# EAGLE design A328 (EAGLE 7.7.0)
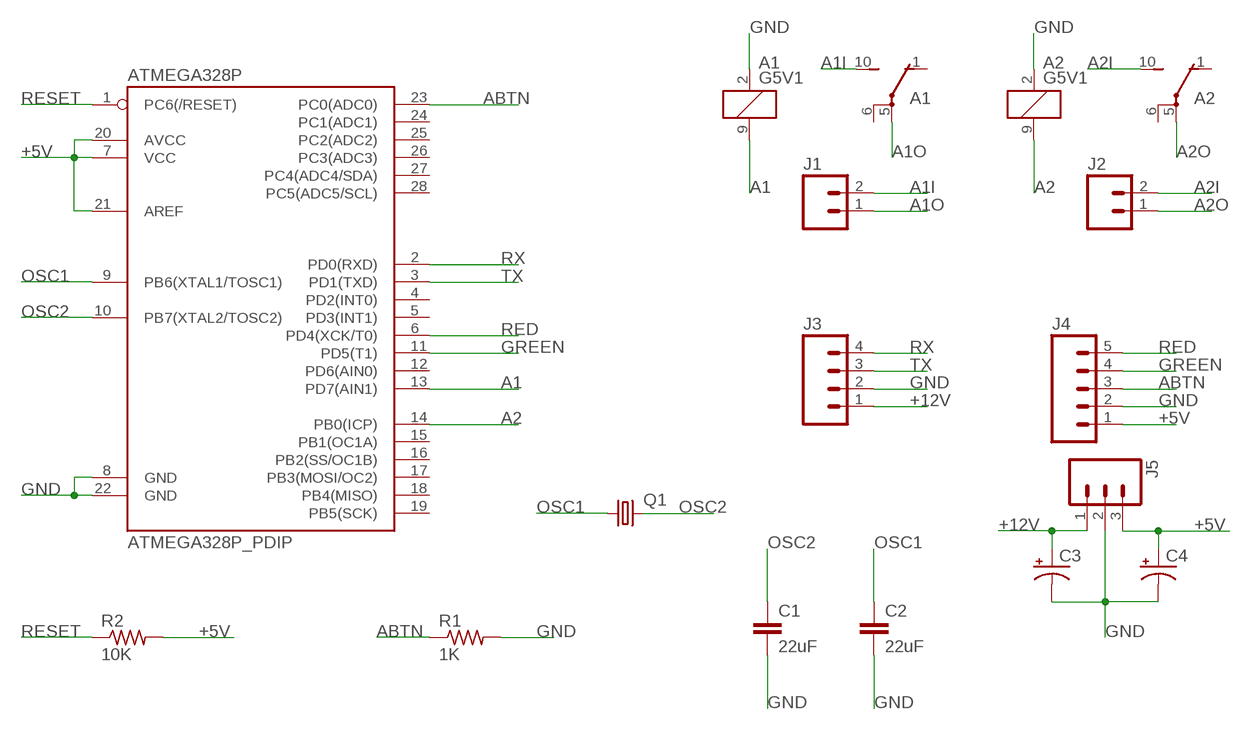
[diagram p0: schematic, sheet 1]

## Parts
A1  G5V1  [G5V1]
A2  G5V1  [G5V1]
ATMEGA328P  ATMEGA328P_PDIP  [DIL28-3]
C1  22uF  CAPKIT  [CAP-PTH-SMALL-KIT]
C2  22uF  CAPKIT  [CAP-PTH-SMALL-KIT]
C3  10UF-25V-20%(PTH)  [CPOL-RADIAL-10UF-25V]
C4  10UF-25V-20%(PTH)  [CPOL-RADIAL-10UF-25V]
J1  M02PTH3  [1X02_LONGPADS]
J2  M02PTH3  [1X02_LONGPADS]
J3  M04NO_SILK_ALL_ROUND  [1X04_NO_SILK_ALL_ROUND]
J4  M05NO_SILK  [1X05_NO_SILK]
J5  M03LONGPADS  [1X03_LONGPADS]
Q1  CRYSTALHC49S  [HC49/S]
R1  1K  R-US_0204/7  [0204/7]
R2  10K  R-US_0204/7  [0204/7]

## Nets
+5V: ATMEGA328P.7(VCC) ATMEGA328P.20(AVCC) ATMEGA328P.21(AREF) C4.1(+) J4.1 J5.3 R2.2
+12V: C3.1(+) J3.1 J5.1
A1: A1.9 ATMEGA328P.13(PD7(AIN1))
A1I: A1.10(2:S) J1.2
A1O: A1.5(2:P) J1.1
A2: A2.9 ATMEGA328P.14(PB0(ICP))
A2I: A2.10(2:S) J2.2
A2O: A2.5(2:P) J2.1
ABTN: ATMEGA328P.23(PC0(ADC0)) J4.3 R1.1
GND: A1.2 A2.2 ATMEGA328P.8(GND) ATMEGA328P.22(GND) C1.2 C2.2 C3.2(-) C4.2(-) J3.2 J4.2 J5.2 R1.2
GREEN: ATMEGA328P.11(PD5(T1)) J4.4
OSC1: ATMEGA328P.9(PB6(XTAL1/TOSC1)) C2.1 Q1.1
OSC2: ATMEGA328P.10(PB7(XTAL2/TOSC2)) C1.1 Q1.2
RED: ATMEGA328P.6(PD4(XCK/T0)) J4.5
RESET: ATMEGA328P.1(PC6(/RESET)) R2.1
RX: ATMEGA328P.2(PD0(RXD)) J3.4
TX: ATMEGA328P.3(PD1(TXD)) J3.3
Unconnected: A1.1(2:O) A1.6(2:P) A2.1(2:O) A2.6(2:P) ATMEGA328P.4(PD2(INT0)) ATMEGA328P.5(PD3(INT1)) ATMEGA328P.12(PD6(AIN0)) ATMEGA328P.15(PB1(OC1A)) ATMEGA328P.16(PB2(SS/OC1B)) ATMEGA328P.17(PB3(MOSI/OC2)) ATMEGA328P.18(PB4(MISO)) ATMEGA328P.19(PB5(SCK)) ATMEGA328P.24(PC1(ADC1)) ATMEGA328P.25(PC2(ADC2)) ATMEGA328P.26(PC3(ADC3)) ATMEGA328P.27(PC4(ADC4/SDA)) ATMEGA328P.28(PC5(ADC5/SCL))

## Library data of the parts
A1 A2 = relay:G5V1: RELAY 1 x switch, 0.5 A/125 V AC, 1 A/24 V DC , Omron; MPN: G5V-1-DC24; OC_FARNELL: 9949593; OC_NEWARK: 36M6377
ATMEGA328P = SparkFun-DigitalIC:ATMEGA328P_PDIP: uC used in the Arduino 32kb flash, 1k EEPROM, 2k SRAM This is the through-hole version of this chip.
C1 C2 = SparkFun-Capacitors:CAP: Capacitor Standard 0603 ceramic capacitor, and 0.1" leaded capacitor.
C3 C4 = SparkFun-Capacitors:10UF-25V-20%(PTH): CAP-08440; PROD_ID: CAP-08440
J1 J2 = SparkFun-Connectors:M02: Standard 2-pin 0.1" header. Use with - straight break away headers ( PRT-00116) - right angle break away headers (PRT-00553) - swiss pins (PRT-00743) - machine pins (PRT-00117) - female headers (PRT-00115) Molex polarized connector foot print use with: PRT-08233 with associated crimp pins and housings. 2.54_SCREWTERM for use with PRT-10571. 3.5mm Screw Terminal footprints for PRT-08084 5mm Screw Terminal footprints for use with PRT-08432
J3 = SparkFun-Connectors:M04: Header 4 Standard 4-pin 0.1" header. Use with straight break away headers (SKU : PRT-00116), right angle break away headers (PRT-00553), swiss pins (PRT-00743), machine pins (PRT-00117), and female headers (PRT-00115). Molex polarized connector foot print use with SKU : PRT-08231 with associated crimp pins and housings. 1MM SMD Version SKU: PRT-10208; PROD_ID: CONN-09696
J4 = SparkFun-Connectors:M05: Header 5 Standard 5-pin 0.1" header. Use with straight break away headers (SKU : PRT-00116), right angle break away headers (PRT-00553), swiss pins (PRT-00743), machine pins (PRT-00117), and female headers (PRT-00115). Molex polarized connector foot print use with SKU : PRT-08230 with associated crimp pins and housings.
J5 = SparkFun-Connectors:M03: Header 3 Standard 3-pin 0.1" header. Use with straight break away headers (SKU : PRT-00116), right angle break away headers (PRT-00553), swiss pins (PRT-00743), machine pins (PRT-00117), and female headers (PRT-00115). Molex polarized connector foot print use with SKU : PRT-08232 with associated crimp pins and housings.
Q1 = crystal:CRYSTAL: CRYSTAL; OC_FARNELL: 1667008; OC_NEWARK: unknown
R1 R2 = resistor:R-US_: RESISTOR, American symbol

## Board
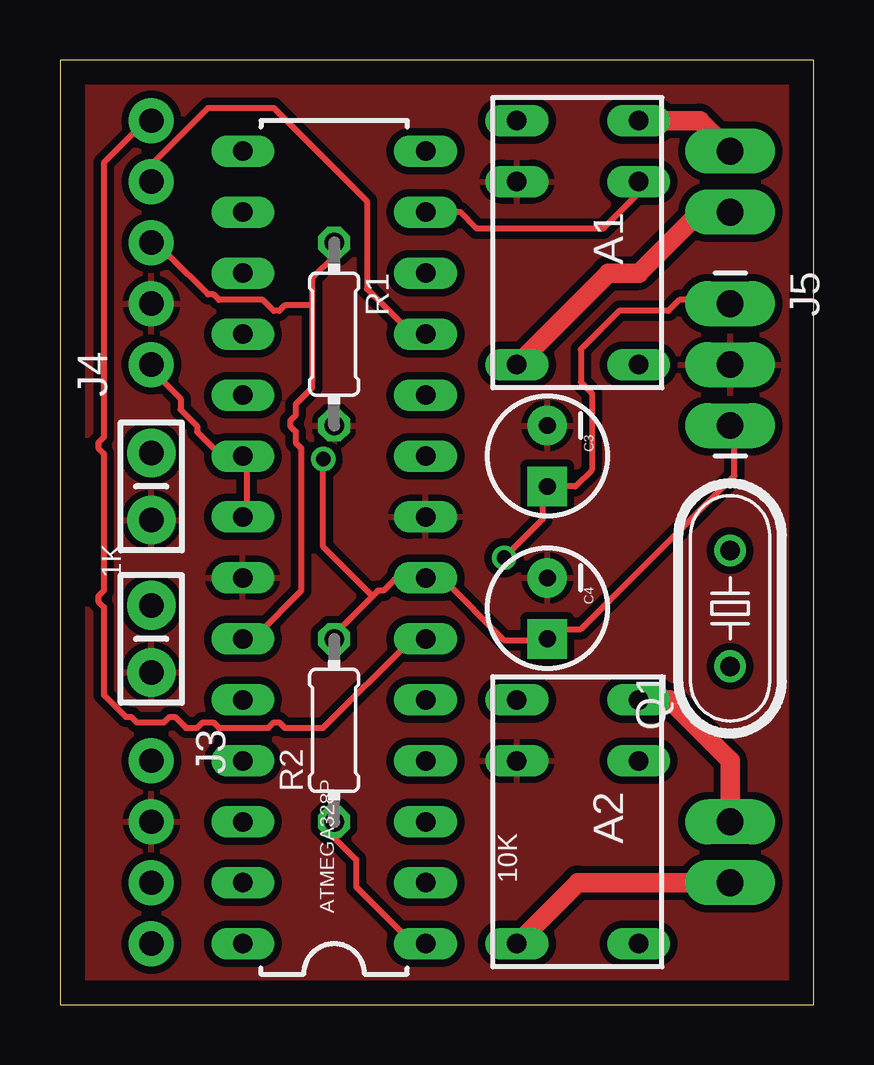
[diagram p1: board, top side]
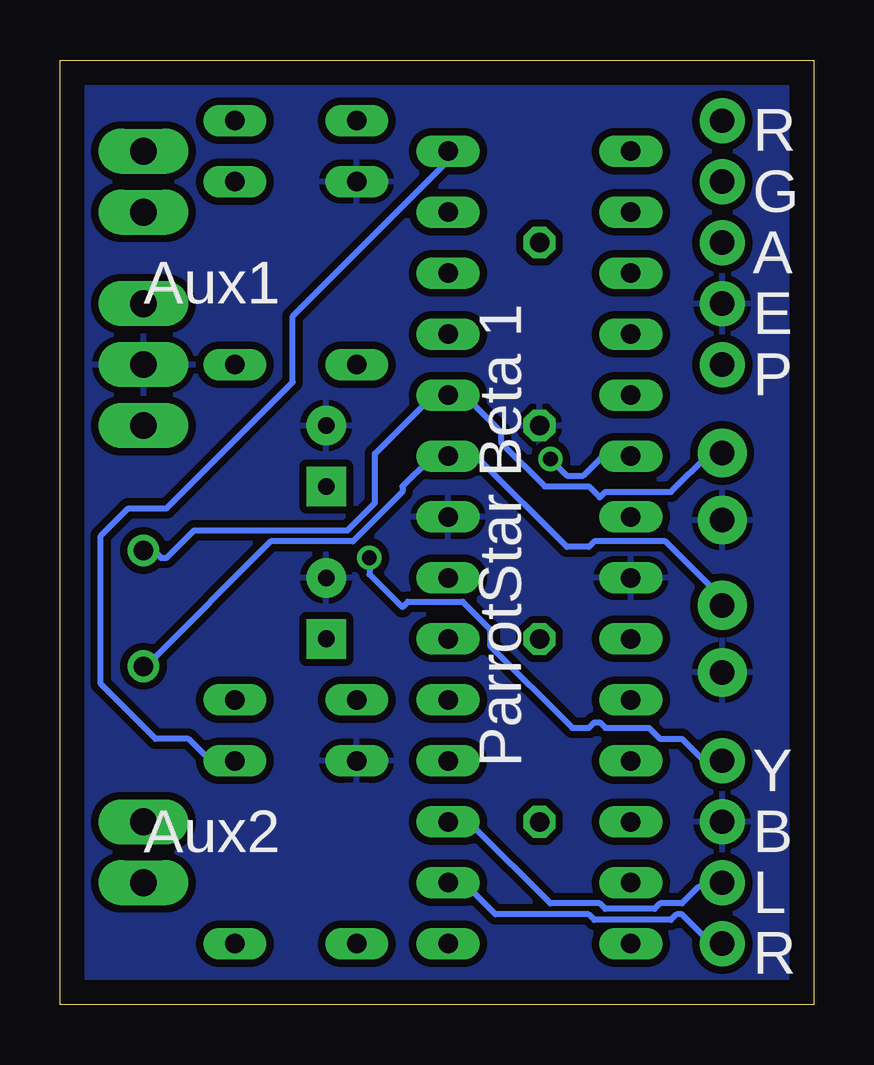
[diagram p2: board, bottom side, seen from below]

Size 31.42 x 39.36 mm. Coordinates in mm from the lower left corner, seen from the top.
Outline: 0,0 31.42,0 31.42,39.36 0,39.36 0,0
Copper layers (1*16): Top 0.035mm / dielectric 1.5mm / Bottom 0.035mm
Design rules "default": minimum track width 10mil, minimum drill 24mil, track to track 8mil, track to pad 8mil, pad to pad 8mil, via to via 8mil, smd to smd 8mil, copper to edge 40mil, drill to drill 8mil, minimum pad ring 10mil, minimum via ring 8mil, stop-mask expansion 4mil, vias tented up to drill 0mil, thermal gap 10mil

### Footprints (pad centres in the part's own frame; a part is rotated, then mirrored left to right if it is on the bottom)
G5V1 = drill 0.813 long: 1 -5.08,-2.54; 2 -2.54,-2.54; 5 5.08,-2.54; 6 5.08,2.54; 9 -2.54,2.54; 10 -5.08,2.54
DIL28-3 = drill 0.813 long: 1 -16.51,-3.81; 2 -13.97,-3.81; 3 -11.43,-3.81; 4 -8.89,-3.81; 5 -6.35,-3.81; 6 -3.81,-3.81; 7 -1.27,-3.81; 8 1.27,-3.81; 9 3.81,-3.81; 10 6.35,-3.81; 11 8.89,-3.81; 12 11.43,-3.81; 13 13.97,-3.81; 14 16.51,-3.81; 15 16.51,3.81; 16 13.97,3.81; 17 11.43,3.81; 18 8.89,3.81; 19 6.35,3.81; 20 3.81,3.81; 21 1.27,3.81; 22 -1.27,3.81; 23 -3.81,3.81; 24 -6.35,3.81; 25 -8.89,3.81; 26 -11.43,3.81; 27 -13.97,3.81; 28 -16.51,3.81
CAP-PTH-SMALL-KIT = drill 1.016 pad 2.032: 1 -1.397,0; 2 1.397,0
CPOL-RADIAL-10UF-25V = drill 0.7 pad 1.651 square: 1 1.27,0 | drill 0.7 pad 1.651: 2 -1.27,0
1X02_LONGPADS = drill 1.118 pad 1.88 long: 1 0,0; 2 2.54,0
1X04_NO_SILK_ALL_ROUND = drill 1.016 pad 1.88: 1 0,0; 2 2.54,0; 3 5.08,0; 4 7.62,0
1X05_NO_SILK = drill 1.016 pad 1.88: 1 0,0; 2 2.54,0; 3 5.08,0; 4 7.62,0; 5 10.16,0
1X03_LONGPADS = drill 1.118 pad 1.88 long: 1 0,0; 2 2.54,0; 3 5.08,0
HC49/S = drill 0.813: 1 -2.413,0; 2 2.413,0
0204/7 = drill 0.813 octagon: 1 -3.81,0; 2 3.81,0

### Placement (x,y rotation side)
A1  21.59,31.75 270 top
A2  21.59,7.62 270 top
ATMEGA328P  11.43,19.05 90 top
C1  3.81,21.59 270 top
C2  3.81,15.24 270 top
C3  20.32,22.86 270 top
C4  20.32,16.51 270 top
J1  27.94,33.02 90 top
J2  27.94,5.08 90 top
J3  3.81,10.16 270 top
J4  3.81,26.67 90 top
J5  27.94,29.21 270 top
Q1  27.94,16.51 90 top
R1  11.43,27.94 270 top
R2  11.43,11.43 90 top

### Tracks (layer width: path | path; a pad name or v marks a point on that pad's centre or on a via)
+5V  (via drill 0.61)
  Top 0.254: ATMEGA328P.21 7.77,20.45 7.77,22.73 ATMEGA328P.20 7.54,22.96 6.63,22.96 5.71,23.88 5.71,24.11 5.03,24.79 5.03,25.25 3.66,26.62 J4.1 | 13.03,17.02 13.26,17.25 13.49,17.25 13.95,17.7 15.09,17.7 ATMEGA328P.7 15.32,17.7 16,17.7 18.52,15.19 20.12,15.19 C4.1 20.34,15.42 20.57,15.65 21.72,15.65 28.12,22.05 28.12,24.11 J5.3 | 13.03,17.02 11.43,15.42 R2.2 | v10.97,22.73 10.97,19.07 13.03,17.02
  Bottom 0.254: v10.97,22.73 10.29,22.05 9.6,22.05 8.91,22.73 7.77,22.73 ATMEGA328P.20
+12V  (via drill 0.61)
  Top 0.254: J5.1 27.89,29.36 25.83,29.36 25.38,28.91 23.32,28.91 21.72,27.3 21.72,25.93 22.17,25.48 22.17,22.28 21.49,21.59 C3.1 20.12,21.59 20.12,20.22 v18.52,18.62
  Bottom 0.254: J3.1 4.57,10.16 5.49,11.07 6.4,11.07 6.86,11.53 8.69,11.53 8.91,11.76 9.14,11.76 9.37,11.53 10.06,11.53 13.49,14.96 13.49,15.65 14.63,16.79 16.92,16.79 17.14,16.56 18.52,17.93 v18.52,18.62
A1
  Top 0.254: ATMEGA328P.13 16.69,33.02 17.37,32.33 22.63,32.33 24,33.71 24,34.16 A1.9
A1I
  Top 0.813: A1.10 26.67,36.83 J1.2
A1O
  Top 0.813: A1.5 22.86,30.48 24.13,30.48 26.67,33.02 J1.1
A2
  Bottom 0.254: A2.9 25.15,10.16 26.06,11.07 27.43,11.07 29.72,13.36 29.72,19.53 28.57,20.68 26.98,20.68 21.72,25.93 21.72,28.68 15.32,35.08 15.32,35.53 ATMEGA328P.14
A2I
  Top 0.813: A2.10 25.4,12.7 27.94,10.16 J2.2
A2O
  Top 0.813: A2.5 21.59,5.08 J2.1
ABTN
  Top 0.254: 10.52,29.13 10.52,30.28 11.43,31.19 R1.1 | 10.52,29.13 10.52,25.71 9.83,25.02 9.83,24.56 9.6,24.33 9.6,24.11 9.83,23.88 9.83,23.42 10.06,23.19 10.06,17.25 8.23,15.42 7.77,15.42 ATMEGA328P.23 | 10.52,29.13 9.37,29.13 9.14,28.91 8.91,28.91 8.46,29.36 6.63,29.36 6.4,29.59 6.17,29.59 4.57,31.19 4.34,31.19 3.89,31.65 J4.3
GND
  pour Top (isolate 0.305): 0,39.37 31.75,39.37 31.75,0 0,0
  pour Bottom (isolate 0.305): 0,39.37 31.75,39.37 31.75,0 0,0
GREEN
  Top 0.254: ATMEGA328P.11 15.09,27.99 14.63,27.99 12.8,29.82 12.8,33.48 8.91,37.36 6.17,37.36 3.89,35.08 3.89,34.39 J4.4
OSC1
  Bottom 0.254: C2.1 3.66,16.79 6.17,19.3 9.14,19.3 9.37,19.07 10.29,19.07 13.95,22.73 15.09,22.73 ATMEGA328P.9 15.32,22.73 16,22.73 17.14,21.59 17.14,21.36 19.2,19.3 22.63,19.3 27.66,14.28 27.89,14.28 Q1.1
OSC2
  Bottom 0.254: Q1.2 27.89,18.85 27.43,18.85 27.2,18.62 26.98,18.62 25.83,19.76 19.43,19.76 18.29,20.9 18.29,22.96 16,25.25 15.32,25.25 ATMEGA328P.10 15.09,25.25 14.4,25.25 13.03,23.88 13.03,23.42 11.2,21.59 9.37,21.59 8.91,21.13 8.69,21.36 5.94,21.36 4.34,22.96 3.89,22.96 C1.1
RED
  Top 0.254: ATMEGA328P.6 15.09,15.19 14.63,15.19 10.97,11.53 9.37,11.53 9.14,11.76 8.91,11.76 8.69,11.53 6.63,11.53 6.4,11.76 5.94,11.76 5.71,11.53 5.26,11.53 4.8,11.99 4.57,11.99 4.34,11.76 3.2,11.76 2.97,11.99 2.74,11.99 1.83,12.9 1.83,16.56 1.6,16.79 1.6,17.02 1.83,17.25 1.83,22.96 1.6,23.19 1.6,23.42 1.83,23.65 1.83,35.08 3.66,36.91 J4.5
RESET
  Top 0.254: R2.1 11.43,6.96 12.34,6.04 12.34,4.9 14.63,2.62 15.09,2.62 ATMEGA328P.1
RX
  Bottom 0.254: ATMEGA328P.2 15.09,4.9 14.4,4.9 13.26,3.76 9.37,3.76 9.14,3.53 5.94,3.53 5.71,3.76 5.49,3.76 4.34,2.62 3.89,2.62 J3.4
TX
  Bottom 0.254: ATMEGA328P.3 15.09,7.42 14.17,7.42 10.97,4.22 8.91,4.22 8.69,3.99 6.63,3.99 6.4,4.22 5.49,4.22 4.8,4.9 3.89,4.9 J3.3

### Text on the board
tNames: 1K | 10K
bNames: R | G | A | ParrotStar Beta 1 | Aux1 | E | P | Y | B | Aux2 | L | R